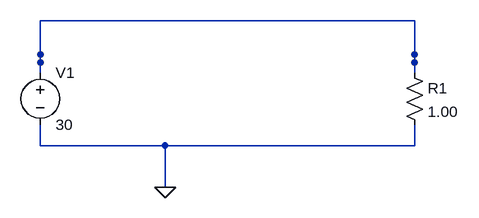
[diagram p0: schematic pannel2.asc]
pannel2.asc, the LTspice schematic file:
Version 4
SHEET 1 880 680
WIRE 896 400 896 372
WIRE 896 512 896 480
SYMBOL res 880 384 R0
SYMATTR InstName R1
SYMATTR Value 1.00
FLAG 512 576 0
WIRE 320 400 320 372
WIRE 320 512 320 480
SYMBOL voltage 320 384 R0
SYMATTR InstName V1
SYMATTR Value 30
WIRE 448 320 512 320
WIRE 512 320 576 320
WIRE 320 320 320 384
WIRE 320 320 384 320
WIRE 640 320 704 320
WIRE 704 320 768 320
WIRE 832 320 896 320
WIRE 896 320 896 384
WIRE 832 512 896 512
WIRE 640 512 704 512
WIRE 704 512 768 512
WIRE 448 512 512 512
WIRE 512 512 512 576
WIRE 512 512 576 512
WIRE 320 512 384 512
WIRE 576 512 640 512
WIRE 384 512 448 512
WIRE 384 320 448 320
WIRE 576 320 640 320
WIRE 768 320 832 320
WIRE 768 512 832 512

The netlist it stands for:
* pannel2.asc
R1 N001 0 1.00
V1 N001 0 30
.backanno
.end